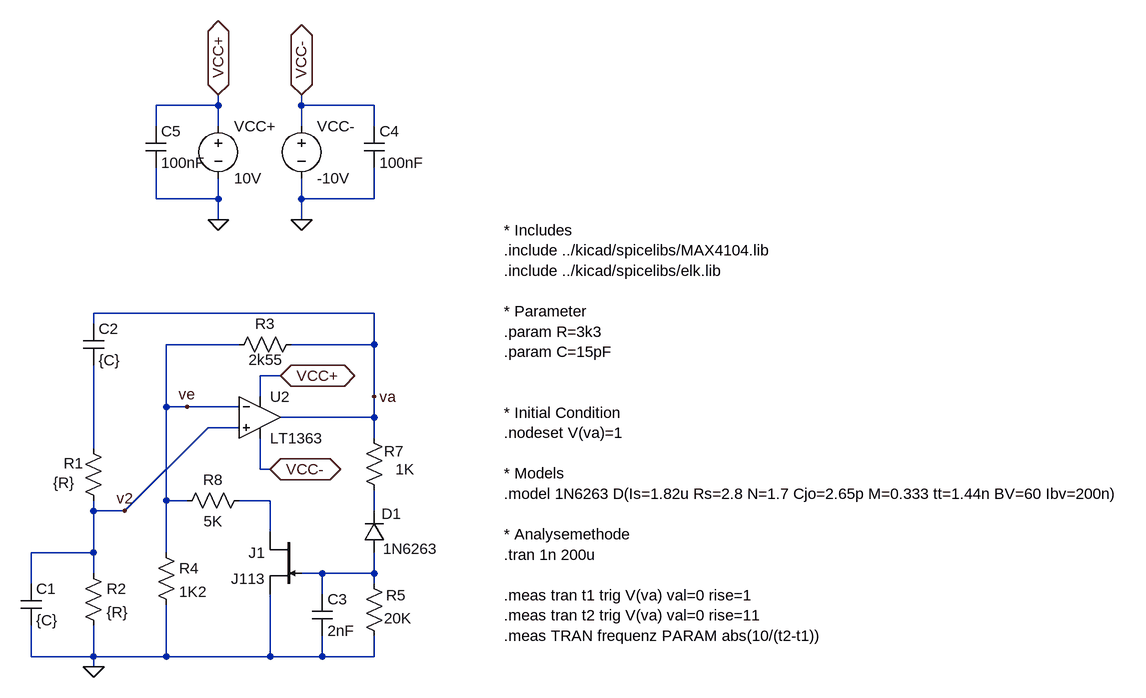
[diagram p0: schematic Wien-VCO-aufbau.asc]
Wien-VCO-aufbau.asc, the LTspice schematic file:
Version 4
SHEET 1 2820 680
WIRE 384 -3024 384 -3040
WIRE 384 -3024 288 -3024
WIRE 512 -3024 512 -3040
WIRE 624 -3024 512 -3024
WIRE 288 -2992 288 -3024
WIRE 384 -2992 384 -3024
WIRE 512 -2992 512 -3024
WIRE 624 -2992 624 -3024
WIRE 288 -2880 288 -2928
WIRE 384 -2880 384 -2912
WIRE 384 -2880 288 -2880
WIRE 512 -2880 512 -2912
WIRE 624 -2880 624 -2928
WIRE 624 -2880 512 -2880
WIRE 384 -2848 384 -2880
WIRE 512 -2848 512 -2880
WIRE 624 -2704 192 -2704
WIRE 192 -2688 192 -2704
WIRE 416 -2656 304 -2656
WIRE 624 -2656 624 -2704
WIRE 624 -2656 496 -2656
WIRE 480 -2608 448 -2608
WIRE 448 -2576 448 -2608
WIRE 624 -2576 624 -2656
WIRE 304 -2560 304 -2656
WIRE 336 -2560 304 -2560
WIRE 416 -2560 336 -2560
WIRE 624 -2544 624 -2576
WIRE 624 -2544 480 -2544
WIRE 416 -2528 368 -2528
WIRE 624 -2512 624 -2544
WIRE 192 -2496 192 -2624
WIRE 448 -2464 448 -2512
WIRE 464 -2464 448 -2464
WIRE 304 -2416 304 -2560
WIRE 336 -2416 304 -2416
WIRE 464 -2416 416 -2416
WIRE 192 -2400 192 -2416
WIRE 240 -2400 368 -2528
WIRE 240 -2400 192 -2400
WIRE 624 -2400 624 -2432
WIRE 464 -2368 464 -2416
WIRE 192 -2336 192 -2400
WIRE 192 -2336 96 -2336
WIRE 304 -2336 304 -2416
WIRE 192 -2304 192 -2336
WIRE 544 -2304 512 -2304
WIRE 624 -2304 624 -2336
WIRE 624 -2304 544 -2304
WIRE 96 -2288 96 -2336
WIRE 624 -2288 624 -2304
WIRE 544 -2272 544 -2304
WIRE 96 -2176 96 -2224
WIRE 192 -2176 192 -2224
WIRE 192 -2176 96 -2176
WIRE 304 -2176 304 -2256
WIRE 304 -2176 192 -2176
WIRE 464 -2176 464 -2272
WIRE 464 -2176 304 -2176
WIRE 544 -2176 544 -2208
WIRE 544 -2176 464 -2176
WIRE 624 -2176 624 -2208
WIRE 624 -2176 544 -2176
WIRE 192 -2160 192 -2176
FLAG 192 -2160 0
FLAG 384 -3040 VCC+
IOPIN 384 -3040 BiDir
FLAG 512 -3040 VCC-
IOPIN 512 -3040 BiDir
FLAG 480 -2608 VCC+
IOPIN 480 -2608 BiDir
FLAG 464 -2464 VCC-
IOPIN 464 -2464 BiDir
FLAG 512 -2848 0
FLAG 384 -2848 0
FLAG 336 -2560 ve
FLAG 624 -2576 va
FLAG 240 -2400 v2
SYMBOL cap 80 -2288 R0
SYMATTR InstName C1
SYMATTR Value {C}
SYMBOL cap 176 -2688 R0
SYMATTR InstName C2
SYMATTR Value {C}
SYMBOL res 176 -2320 R0
SYMATTR InstName R2
SYMATTR Value {R}
SYMBOL res 288 -2352 R0
SYMATTR InstName R4
SYMATTR Value 1K2
SYMBOL res 432 -2432 R90
WINDOW 0 0 56 VBottom 2
WINDOW 3 32 56 VTop 2
SYMATTR InstName R8
SYMATTR Value 5K
SYMBOL res 640 -2192 R180
WINDOW 0 -33 78 Left 2
WINDOW 3 -42 43 Left 2
SYMATTR InstName R5
SYMATTR Value 20K
SYMBOL res 640 -2416 R180
WINDOW 0 -30 76 Left 2
WINDOW 3 -46 48 Left 2
SYMATTR InstName R7
SYMATTR Value 1K
SYMBOL res 400 -2640 R270
WINDOW 0 32 56 VTop 2
WINDOW 3 8 57 VBottom 2
SYMATTR InstName R3
SYMATTR Value 2k55
SYMBOL res 176 -2512 R0
WINDOW 0 -30 39 Left 2
WINDOW 3 -46 69 Left 2
SYMATTR InstName R1
SYMATTR Value {R}
SYMBOL diode 640 -2336 R180
WINDOW 0 -26 60 Left 2
WINDOW 3 -82 6 Left 2
SYMATTR InstName D1
SYMATTR Value 1N6263
SYMBOL cap 528 -2272 R0
SYMATTR InstName C3
SYMATTR Value 2nF
SYMBOL voltage 512 -3008 R0
WINDOW 123 0 0 Left 0
WINDOW 39 0 0 Left 0
SYMATTR InstName VCC-
SYMATTR Value -10V
SYMBOL voltage 384 -3008 R0
SYMATTR InstName VCC+
SYMATTR Value 10V
SYMBOL njf 512 -2368 M0
SYMATTR InstName J1
SYMATTR Value J113
SYMBOL cap 608 -2992 R0
SYMATTR InstName C4
SYMATTR Value 100nF
SYMBOL cap 272 -2992 R0
SYMATTR InstName C5
SYMATTR Value 100nF
SYMBOL OpAmps/LT1363 448 -2608 R0
SYMATTR InstName U2
TEXT 824 -2832 Left 2 !* Includes\n.include ../kicad/spicelibs/MAX4104.lib\n.include ../kicad/spicelibs/elk.lib\n \n* Parameter\n.param R=3k3\n.param C=15pF\n \n \n* Initial Condition\n.nodeset V(va)=1\n \n* Models\n.model 1N6263 D(Is=1.82u Rs=2.8 N=1.7 Cjo=2.65p M=0.333 tt=1.44n BV=60 Ibv=200n)\n \n* Analysemethode\n.tran 1n 200u\n \n.meas tran t1 trig V(va) val=0 rise=1\n.meas tran t2 trig V(va) val=0 rise=11\n.meas TRAN frequenz PARAM abs(10/(t2-t1))

The netlist it stands for:
* Wien-VCO-aufbau.asc
C1 v2 0 {C}
C2 va N001 {C}
R2 v2 0 {R}
R4 ve 0 1K2
R8 N002 ve 5K
R5 0 N004 20K
R7 N003 va 1K
R3 ve va 2k55
R1 N001 v2 {R}
D1 N004 N003 1N6263
C3 N004 0 2nF
VCC- VCC- 0 -10V
VCC+ VCC+ 0 10V
J1 N002 N004 0 J113
C4 VCC- 0 100nF
C5 VCC+ 0 100nF
XU2 v2 ve VCC+ VCC- va LT1363  ; pins In+ In- V+ V- OUT
.model D D
.lib standard.dio
.model NJF NJF
.model PJF PJF
.lib standard.jft
* Includes
.include ../kicad/spicelibs/MAX4104.lib
.include ../kicad/spicelibs/elk.lib
* Parameter
.param R=3k3
.param C=15pF
* Initial Condition
.nodeset V(va)=1
* Models
.model 1N6263 D(Is=1.82u Rs=2.8 N=1.7 Cjo=2.65p M=0.333 tt=1.44n BV=60 Ibv=200n)
* Analysemethode
.tran 1n 200u
.meas tran t1 trig V(va) val=0 rise=1
.meas tran t2 trig V(va) val=0 rise=11
.meas TRAN frequenz PARAM abs(10/(t2-t1))
.lib LT1363.sub
.backanno
.end